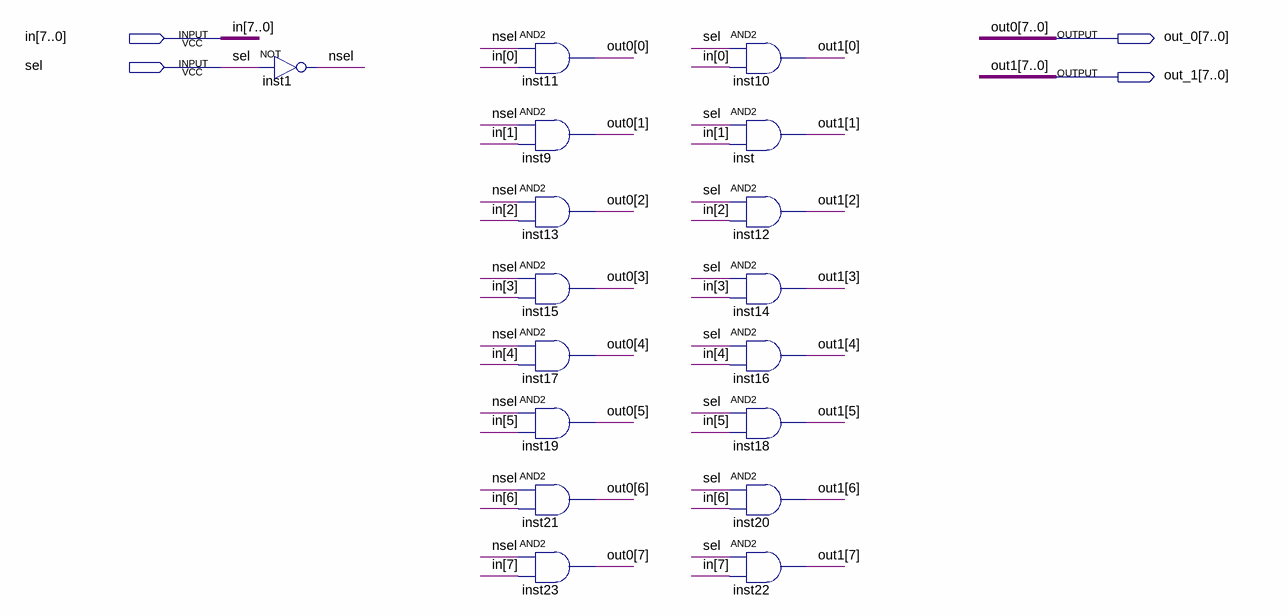
[diagram p0: schematic sheet]
// Quartus schematic dmux8x2.bdf as structural Verilog: 17 symbols, 4 pins
module dmux8x2 (
  input  [7:0] in,
  input  sel,
  output [7:0] out_0,
  output [7:0] out_1
);

  wire nsel;

  not inst1 (nsel, sel);
  and inst11 (out_0[0], nsel, in[0]);
  and inst9 (out_0[1], nsel, in[1]);
  and inst13 (out_0[2], nsel, in[2]);
  and inst15 (out_0[3], nsel, in[3]);
  and inst17 (out_0[4], nsel, in[4]);
  and inst19 (out_0[5], nsel, in[5]);
  and inst21 (out_0[6], nsel, in[6]);
  and inst23 (out_0[7], nsel, in[7]);
  and inst10 (out_1[0], sel, in[0]);
  and inst (out_1[1], sel, in[1]);
  and inst12 (out_1[2], sel, in[2]);
  and inst14 (out_1[3], sel, in[3]);
  and inst16 (out_1[4], sel, in[4]);
  and inst18 (out_1[5], sel, in[5]);
  and inst20 (out_1[6], sel, in[6]);
  and inst22 (out_1[7], sel, in[7]);

  // Other names for the same wires on the sheet: out0[7:0] = out_0; out1[7:0] = out_1
endmodule
